# Altium schematic sheet power.SchDoc
size A4
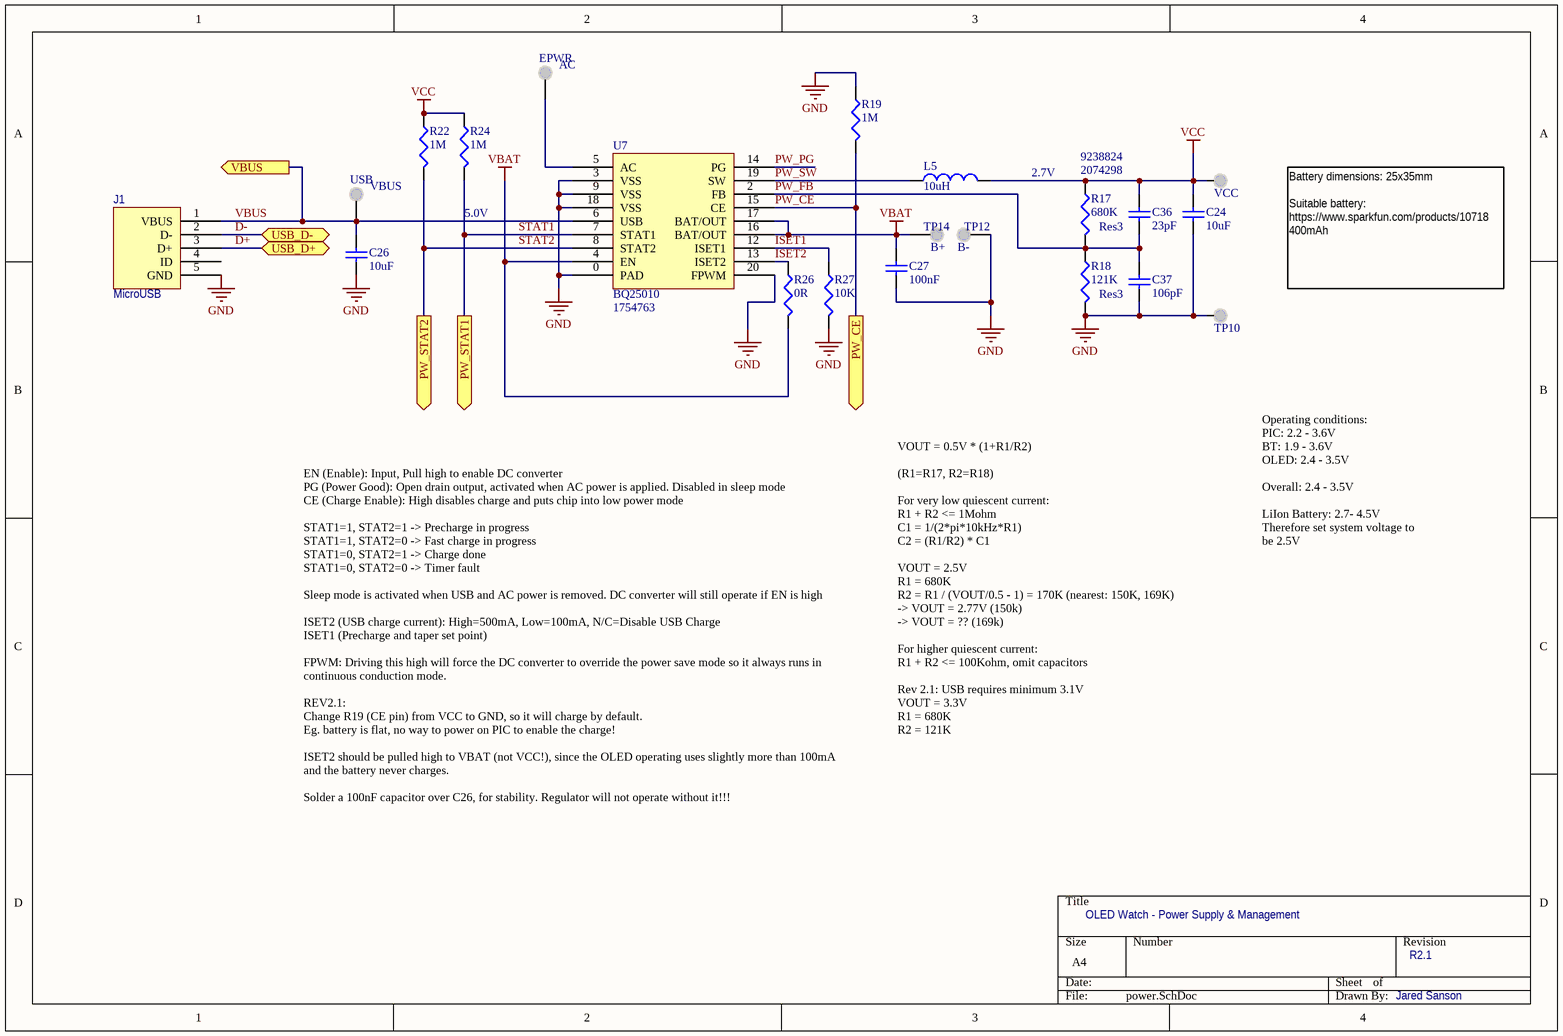
[diagram p0: power.SchDoc]

## Parts
C24  value 10uF  [0805C]  (hidden comment: Cap)
C26  value 10uF  [0805C]  (hidden comment: Cap)
C27  value 100nF  [0603C]  (hidden comment: Cap)
C36  value 23pF  [0603C]  (hidden comment: Cap)
C37  value 106pF  [0603C]  (hidden comment: Cap)
EPWR  AC  [TESTPOINT_TOP]
J1  MicroUSB  [MICRO_USB]
L5  value 10uH  [INDC3225N]  (hidden comment: Inductor)
R17  Res3  value 680K  Supplier Part Number 1: 2074298  Supplier Part Number 2: 9238824  [0603R]
R18  Res3  value 121K  [0603R]
R19  value 1M  [0603R]  (hidden comment: Res3)
R22  value 1M  [0603R]  (hidden comment: Res3)
R24  value 1M  [0603R]  (hidden comment: Res3)
R26  value 0R  [0603R]  (hidden comment: Res3)
R27  value 10K  [0603R]  (hidden comment: Res3)
TP10  GND  [TESTPOINT_TOP]  (value not drawn)
TP12  B-  [TESTPOINT_TOP]
TP14  B+  [TESTPOINT_TOP]
U7  BQ25010  Supplier Part Number 1: 1754763  [RHL]
USB  VBUS  [TESTPOINT_TOP]
VCC  VCC  [TESTPOINT_TOP]  (value not drawn)

## Ports
PW_CE (out), PW_STAT1 (out), PW_STAT2 (out), USB_D+ (bidir), USB_D- (bidir), VBUS (out)

## Nets
GND: C24.2 C26.2 C27.2 C37.2 J1.5(GND) R18.2 R19.1 R27.2 TP10.1(TP) TP12.1(TP) U7.0(PAD) U7.3(VSS) U7.9(VSS) U7.18(VSS) U7.20(FPWM)
VBAT: C27.1 R26.2 TP14.1(TP) U7.4(EN) U7.16(BAT/OUT) U7.17(BAT/OUT)
VCC: C24.1 C36.1 L5.2 R17.1 R22.1 R24.1 VCC.1(TP)
D+: J1.3(D+) ; port USB_D+
D-: J1.2(D-) ; port USB_D-
ISET1: R27.1 U7.12(ISET1)
ISET2: R26.1 U7.13(ISET2)
PW_CE: R19.2 U7.15(CE) ; port PW_CE
PW_FB: C36.2 C37.1 R17.2 R18.1 U7.2(FB)
PW_PG: U7.14(PG)
PW_SW: L5.1 U7.19(SW)
STAT1: R24.2 U7.7(STAT1) ; port PW_STAT1
STAT2: R22.2 U7.8(STAT2) ; port PW_STAT2
VBUS: C26.1 J1.1(VBUS) U7.6(USB) USB.1(TP) ; port VBUS
NetEPWR_1: EPWR.1(TP) U7.5(AC)

Not connected (* = marked no-connect by the designer): J1 4(ID)

## Notes on the sheet
- (near R17) 2.7V
- 5.0V
- Battery dimensions: 25x35mm
  Suitable battery:
  https://www.sparkfun.com/products/10718
  400mAh
- Operating conditions:
  PIC: 2.2 - 3.6V
  BT: 1.9 - 3.6V
  OLED: 2.4 - 3.5V
  Overall: 2.4 - 3.5V
  LiIon Battery: 2.7- 4.5V
  Therefore set system voltage to be 2.5V
- VOUT = 0.5V * (1+R1/R2)
  (R1=R17, R2=R18)
  For very low quiescent current:
  R1 + R2 <= 1Mohm
  C1 = 1/(2*pi*10kHz*R1)
  C2 = (R1/R2) * C1
  VOUT = 2.5V
  R1 = 680K
  R2 = R1 / (VOUT/0.5 - 1) = 170K (nearest: 150K, 169K)
  -> VOUT = 2.77V (150k)
  -> VOUT = ?? (169k)
  For higher quiescent current:
  R1 + R2 <= 100Kohm, omit capacitors
  Rev 2.1: USB requires minimum 3.1V
  VOUT = 3.3V
  R1 = 680K
  R2 = 121K
- EN (Enable): Input, Pull high to enable DC converter
  PG (Power Good): Open drain output, activated when AC power is applied. Disabled in sleep mode
  CE (Charge Enable): High disables charge and puts chip into low power mode
  STAT1=1, STAT2=1 -> Precharge in progress
  STAT1=1, STAT2=0 -> Fast charge in progress
  STAT1=0, STAT2=1 -> Charge done
  STAT1=0, STAT2=0 -> Timer fault
  Sleep mode is activated when USB and AC power is removed. DC converter will still operate if EN is high
  ISET2 (USB charge current): High=500mA, Low=100mA, N/C=Disable USB Charge
  ISET1 (Precharge and taper set point)
  FPWM: Driving this high will force the DC converter to override the power save mode so it always runs in continuous conduction mode.
  REV2.1:
  Change R19 (CE pin) from VCC to GND, so it will charge by default.
  Eg. battery is flat, no way to power on PIC to enable the charge!
  ISET2 should be pulled high to VBAT (not VCC!), since the OLED operating uses slightly more than 100mA and the battery never charges.
  Solder a 100nF capacitor over C26, for stability. Regulator will not operate without it!!!
- OLED Watch - Power Supply & Management
- R2.1
- Jared Sanson

## Library data of the parts
C24 C26 C27 C36 C37 = Cap: Capacitor; Published: 8-Jun-2000; LatestRevisionDate: 17-Jul-2002; LatestRevisionNote: Re-released for DXP Platform.; PackageReference: RAD-0.3; Publisher: Altium Limited; PackageDescription: Radial Cap, Thru-Hole; 2 Leads; 0.3 in Pin Spacing
EPWR TP10 TP12 TP14 USB VCC = TestPoint: Test Point; Comment_1: *
L5 = Inductor: Code_IEC: 1005; Published: 8-Jun-2000; LatestRevisionDate: 29-May-2009; LatestRevisionNote: IPC-7351 Footprint Added.; PackageReference: 0402-A; Publisher: Altium Limited; PackageDescription: Chip Inductor; Code_JEITA: 0402
R17-R19 R22 R24 R26 R27 = Res3: Resistor; Published: 8-Jun-2000; LatestRevisionDate: 29-May-2009; LatestRevisionNote: IPC-7351 Footprint Added.; PackageReference: J1-0603; Publisher: Altium Limited; PackageDescription: Chip Resistor
  R17 R18: Supplier 1: Farnell; Supplier 2: Farnell
U7 = BQ25010: Supplier 1: Farnell